# EAGLE schematic BMS Segment Jeff v2 (EAGLE 8.1.0)
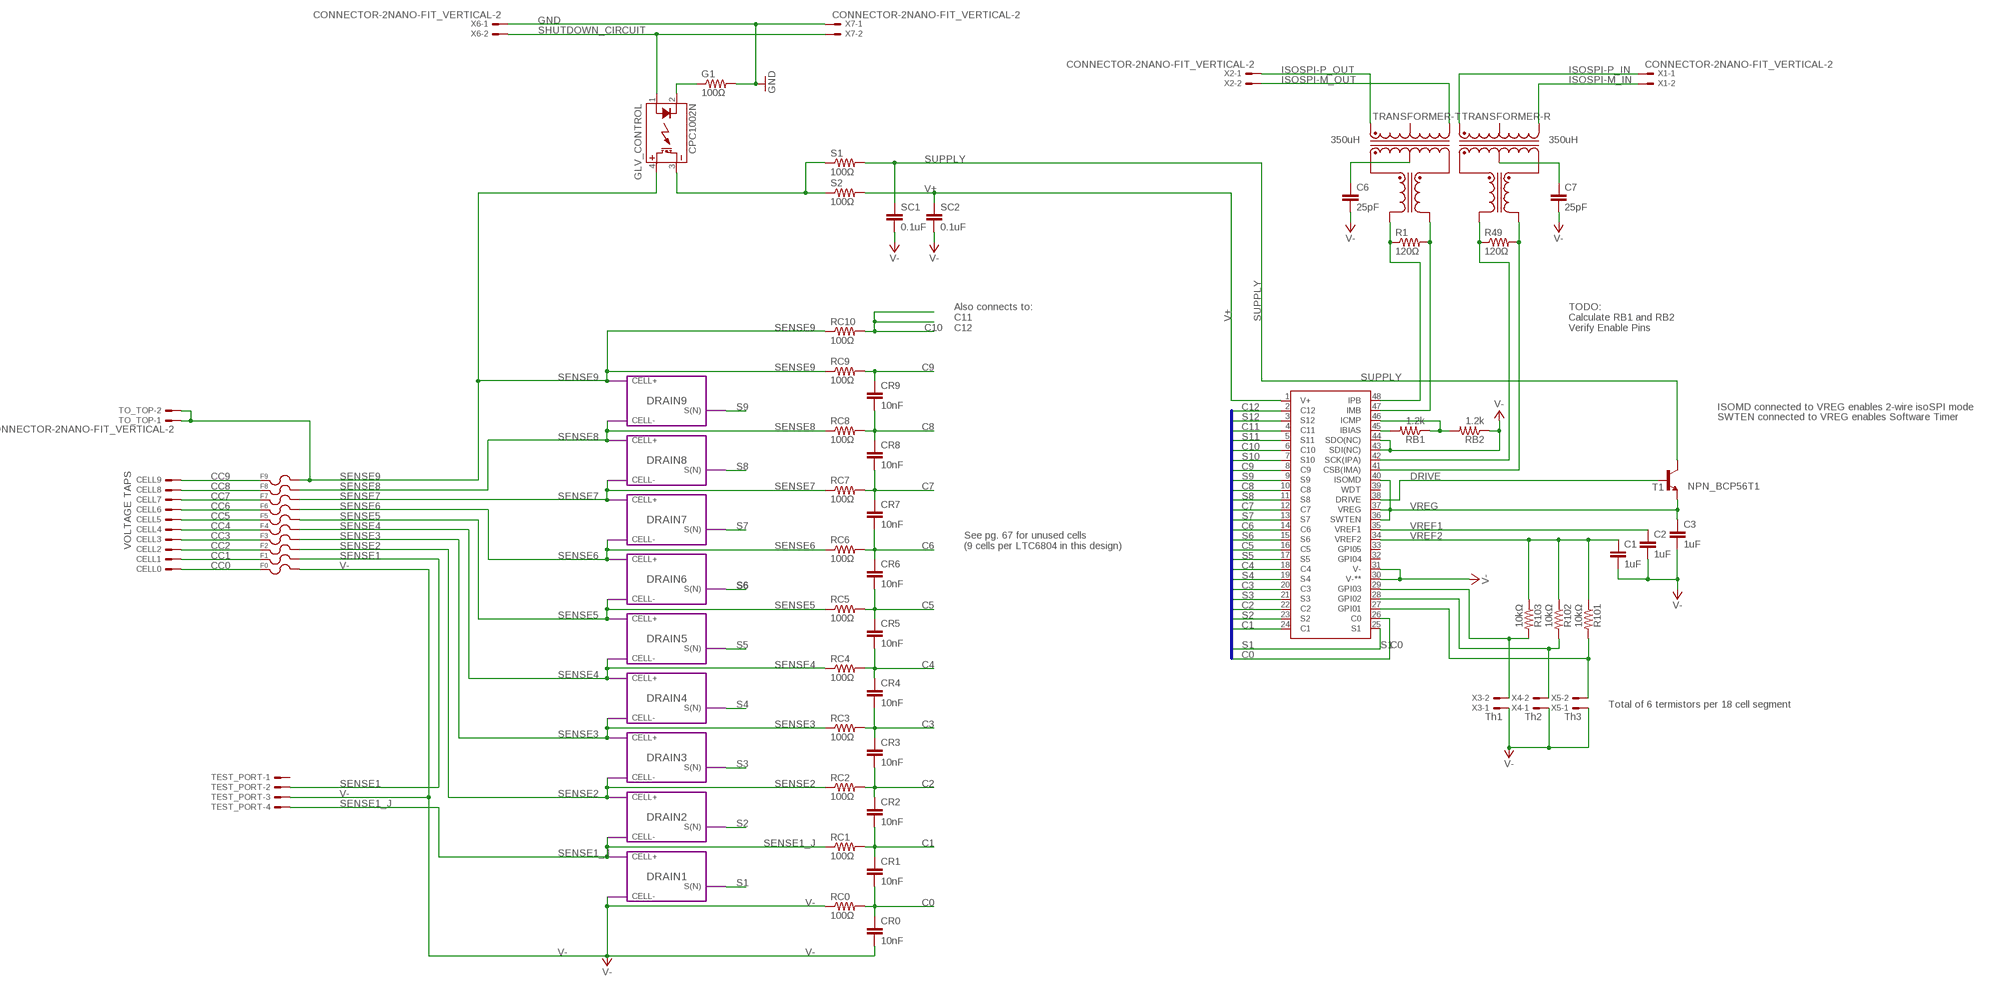
[diagram p0: schematic, sheet 1]

## Parts
C1  1uF  CAP0805  [0805]
C2  1uF  CAP0805  [0805]
C3  1uF  CAP0805  [0805]
C6  25pF  CAP0805  [0805]
C7  25pF  CAP0805  [0805]
CELL0  BATTERY_SPRING_KEYSTONE5222  [KEYSTONE5222]
CELL1  BATTERY_SPRING_KEYSTONE5222  [KEYSTONE5222]
CELL2  BATTERY_SPRING_KEYSTONE5222  [KEYSTONE5222]
CELL3  BATTERY_SPRING_KEYSTONE5222  [KEYSTONE5222]
CELL4  BATTERY_SPRING_KEYSTONE5222  [KEYSTONE5222]
CELL5  BATTERY_SPRING_KEYSTONE5222  [KEYSTONE5222]
CELL6  BATTERY_SPRING_KEYSTONE5222  [KEYSTONE5222]
CELL7  BATTERY_SPRING_KEYSTONE5222  [KEYSTONE5222]
CELL8  BATTERY_SPRING_KEYSTONE5222  [KEYSTONE5222]
CELL9  BATTERY_SPRING_KEYSTONE5222  [KEYSTONE5222]
CR0  10nF  CAP0805  [0805]
CR1  10nF  CAP0805  [0805]
CR2  10nF  CAP0805  [0805]
CR3  10nF  CAP0805  [0805]
CR4  10nF  CAP0805  [0805]
CR5  10nF  CAP0805  [0805]
CR6  10nF  CAP0805  [0805]
CR7  10nF  CAP0805  [0805]
CR8  10nF  CAP0805  [0805]
CR9  10nF  CAP0805  [0805]
F0  0751.0110_FUSE_CLIP  [0751.0110]
F1  0751.0110_FUSE_CLIP  [0751.0110]
F2  0751.0110_FUSE_CLIP  [0751.0110]
F3  0751.0110_FUSE_CLIP  [0751.0110]
F4  0751.0110_FUSE_CLIP  [0751.0110]
F5  0751.0110_FUSE_CLIP  [0751.0110]
F6  0751.0110_FUSE_CLIP  [0751.0110]
F7  0751.0110_FUSE_CLIP  [0751.0110]
F8  0751.0110_FUSE_CLIP  [0751.0110]
F9  0751.0110_FUSE_CLIP  [0751.0110]
G1  100Ω  RESISTOR0805-RES  [0805]
GLV_CONTROL  CPC1002N  [SOP04]
R1  120Ω  RESISTOR0805-RES  [0805]
R49  120Ω  RESISTOR0805-RES  [0805]
R101  10kΩ  RESISTOR0805-RES  [0805]
R102  10kΩ  RESISTOR0805-RES  [0805]
R103  10kΩ  RESISTOR0805-RES  [0805]
RB1  1.2k  RESISTOR0805-RES  [0805]
RB2  1.2k  RESISTOR0805-RES  [0805]
RC0  100Ω  RESISTOR0805-RES  [0805]
RC1  100Ω  RESISTOR0805-RES  [0805]
RC2  100Ω  RESISTOR0805-RES  [0805]
RC3  100Ω  RESISTOR0805-RES  [0805]
RC4  100Ω  RESISTOR0805-RES  [0805]
RC5  100Ω  RESISTOR0805-RES  [0805]
RC6  100Ω  RESISTOR0805-RES  [0805]
RC7  100Ω  RESISTOR0805-RES  [0805]
RC8  100Ω  RESISTOR0805-RES  [0805]
RC9  100Ω  RESISTOR0805-RES  [0805]
RC10  100Ω  RESISTOR0805-RES  [0805]
S1  100Ω  RESISTOR0805-RES  [0805]
S2  100Ω  RESISTOR0805-RES  [0805]
SC1  0.1uF  CAP0805  [0805]
SC2  0.1uF  CAP0805  [0805]
T1  NPN_BCP56T1  [SOT223]
TEST_PORT  MINIFIT_5566-4  [MINIFIT_5566-4]
TO_TOP  CONNECTOR-2NANO-FIT_VERTICAL-2  [NANO-FIT_VERTICAL-2]
TRANSFORMER-  350uH  TRANSFORMER_749010013  [749010013]
U$2  LTC6804-1  [LTC6804]
X1  CONNECTOR-2NANO-FIT_VERTICAL-2  [NANO-FIT_VERTICAL-2]
X2  CONNECTOR-2NANO-FIT_VERTICAL-2  [NANO-FIT_VERTICAL-2]
X3  Th1  CONNECTOR-2NANO-FIT_VERTICAL-2  [NANO-FIT_VERTICAL-2]
X4  Th2  CONNECTOR-2NANO-FIT_VERTICAL-2  [NANO-FIT_VERTICAL-2]
X5  Th3  CONNECTOR-2NANO-FIT_VERTICAL-2  [NANO-FIT_VERTICAL-2]
X6  CONNECTOR-2NANO-FIT_VERTICAL-2  [NANO-FIT_VERTICAL-2]
X7  CONNECTOR-2NANO-FIT_VERTICAL-2  [NANO-FIT_VERTICAL-2]

## Module instances
DRAIN1 = DRAIN
DRAIN2 = DRAIN
DRAIN3 = DRAIN
DRAIN4 = DRAIN
DRAIN5 = DRAIN
DRAIN6 = DRAIN
DRAIN7 = DRAIN
DRAIN8 = DRAIN
DRAIN9 = DRAIN

## Nets
C0: CR0.1 CR1.2 RC0.2 U$2.26(C0)
C1: CR1.1 CR2.2 RC1.2 U$2.24(C1)
C2: CR2.1 CR3.2 RC2.2 U$2.22(C2)
C3: CR3.1 CR4.2 RC3.2 U$2.20(C3)
C4: CR4.1 CR5.2 RC4.2 U$2.18(C4)
C5: CR5.1 CR6.2 RC5.2 U$2.16(C5)
C6: CR6.1 CR7.2 RC6.2 U$2.14(C6)
C7: CR7.1 CR8.2 RC7.2 U$2.12(C7)
C8: CR8.1 CR9.2 RC8.2 U$2.10(C8)
C9: CR9.1 RC9.2 U$2.8(C9)
C10: RC10.2 U$2.6(C10)
C11: U$2.4(C11)
C12: U$2.2(C12)
CC0: CELL0.P$1(S) F0.L1 F0.L2
CC1: CELL1.P$1(S) F1.L1 F1.L2
CC2: CELL2.P$1(S) F2.L1 F2.L2
CC3: CELL3.P$1(S) F3.L1 F3.L2
CC4: CELL4.P$1(S) F4.L1 F4.L2
CC5: CELL5.P$1(S) F5.L1 F5.L2
CC6: CELL6.P$1(S) F6.L1 F6.L2
CC7: CELL7.P$1(S) F7.L1 F7.L2
CC8: CELL8.P$1(S) F8.L1 F8.L2
CC9: CELL9.P$1(S) F9.L1 F9.L2
DRIVE: T1.1(BASE) U$2.38(DRIVE)
GND: G1.2 X6.1 X7.1
ISOSPI-M_IN: TRANSFORMER-.8(R:D-) X1.2
ISOSPI-M_OUT: TRANSFORMER-.3(T:D-) X2.2
ISOSPI-P_IN: TRANSFORMER-.6(R:D+) X1.1
ISOSPI-P_OUT: TRANSFORMER-.1(T:D+) X2.1
N$1: C7.1 TRANSFORMER-.10(R:CX)
N$2: C6.1 TRANSFORMER-.15(T:CX)
N$4: RB1.2 U$2.45(IBIAS)
N$5: R1.1 TRANSFORMER-.16(T:X+) U$2.48(IPB)
N$7: RB1.1 RB2.2 U$2.46(ICMP)
N$8: R49.1 TRANSFORMER-.11(R:X+) U$2.42(SCK(IPA))
N$9: R49.2 TRANSFORMER-.9(R:X-) U$2.41(CSB(IMA))
N$42: R1.2 TRANSFORMER-.14(T:X-) U$2.47(IMB)
S1: U$2.25(S1) ; port DRAIN1.S(N)
S2: U$2.23(S2) ; port DRAIN2.S(N)
S3: U$2.21(S3) ; port DRAIN3.S(N)
S4: U$2.19(S4) ; port DRAIN4.S(N)
S5: U$2.17(S5) ; port DRAIN5.S(N)
S6: U$2.15(S6) ; port DRAIN6.S(N)
S7: U$2.13(S7) ; port DRAIN7.S(N)
S8: U$2.11(S8) ; port DRAIN8.S(N)
S9: U$2.9(S9) ; port DRAIN9.S(N)
S10: U$2.7(S10)
S11: U$2.5(S11)
S12: U$2.3(S12)
SENSE1: F1.R1 F1.R2 TEST_PORT.2
SENSE1_J: RC1.1 TEST_PORT.4 ; port DRAIN1.CELL+ DRAIN2.CELL-
SENSE2: F2.R1 F2.R2 RC2.1 ; port DRAIN2.CELL+ DRAIN3.CELL-
SENSE3: F3.R1 F3.R2 RC3.1 ; port DRAIN3.CELL+ DRAIN4.CELL-
SENSE4: F4.R1 F4.R2 RC4.1 ; port DRAIN4.CELL+ DRAIN5.CELL-
SENSE5: F5.R1 F5.R2 RC5.1 ; port DRAIN5.CELL+ DRAIN6.CELL-
SENSE6: F6.R1 F6.R2 RC6.1 ; port DRAIN6.CELL+ DRAIN7.CELL-
SENSE7: F7.R1 F7.R2 RC7.1 ; port DRAIN7.CELL+ DRAIN8.CELL-
SENSE8: F8.R1 F8.R2 RC8.1 ; port DRAIN8.CELL+ DRAIN9.CELL-
SENSE9: F9.R1 F9.R2 GLV_CONTROL.4(DC+) RC9.1 RC10.1 TO_TOP.1 TO_TOP.2 ; port DRAIN9.CELL+
SHUTDOWN_CIRCUIT: GLV_CONTROL.1(CONTROL+) X6.2 X7.2
SSR-: G1.1 GLV_CONTROL.2(CONTROL-)
SUPPLY: S1.2 SC1.1 T1.2(COLLECTOR) T1.4(COLLECTOR)
SUPPLY_INTER: GLV_CONTROL.3(DC-) S1.1 S2.1
THERMISTOR1: R101.2 U$2.27(GPI01) X5.2
THERMISTOR2: R102.2 U$2.28(GPI02) X4.2
THERMISTOR3: R103.2 U$2.29(GPI03) X3.2
V+: S2.2 SC2.1 U$2.1(V+)
V-: C1.2 C2.2 C3.2 C6.2 C7.2 CR0.2 F0.R1 F0.R2 RB2.1 RC0.1 SC1.2 SC2.2 TEST_PORT.3 U$2.30(V-**) U$2.31(V-) U$2.43(SDI(NC)) U$2.44(SDO(NC)) X3.1 X4.1 X5.1 ; port DRAIN1.CELL-
VREF1: C2.1 U$2.35(VREF1)
VREF2: C1.1 R101.1 R102.1 R103.1 U$2.34(VREF2)
VREG: C3.1 T1.3(EMITTER) U$2.36(SWTEN) U$2.37(VREG) U$2.40(ISOMD)
Unconnected: TEST_PORT.1 TRANSFORMER-.2(T:CD) TRANSFORMER-.7(R:CD) U$2.32(GPI04) U$2.33(GPI05) U$2.39(WDT)

## Buses
C[0..12],S[1..12]

## Notes on the sheet
- Also connects to:
  C11
  C12
- TODO:
  Calculate RB1 and RB2
  Verify Enable Pins
- ISOMD connected to VREG enables 2-wire isoSPI mode
- SWTEN connected to VREG enables Software Timer
- VOLTAGE TAPS
- See pg. 67 for unused cells
  (9 cells per LTC6804 in this design)
- Total of 6 termistors per 18 cell segment

## Library data of the parts
C1-C3 C6 C7 CR0 CR1-CR9 SC1 SC2 = HyTechDevices:CAP: Capacitor Standard 0603 ceramic capacitor, and 0.1" leaded capacitor.
CELL0 CELL1-CELL9 = HyTechDevices:BATTERY_SPRING
F0 F1-F9 = HyTechDevices:0751.0110_FUSE_CLIP: Schurter 0751.0110 Brass Fuse Clip Datasheet <http://www.mouser.com/ds/2/358/typ_OG__Clip__5x20-2553.pdf>
G1 R1 R49 R101-R103 RB1 RB2 RC0 RC1-RC10 S1 S2 = HyTechDevices:RESISTOR: Resistor Basic schematic elements and footprints for 0603, 1206, and PTH resistors.
GLV_CONTROL = HyTechDevices:CPC1002N: IXYS Solid State Relay .7A
T1 = HyTechDevices:NPN_BCP56T1: ON Semiconductor BCP56 Series NPN Silicon Epitaxial Transistor Datasheet <http://www.mouser.com/ds/2/308/BCP56T1-D-104805.pdf>
TEST_PORT = HyTechDevices:MINIFIT_5566-4: Mini-Fit Junior connector 4 pole Source: http://www.molex.com; OC_FARNELL: unknown; OC_NEWARK: unknown
TO_TOP X1-X7 = HyTechDevices:CONNECTOR-2: Mini-Fit Junior connector 2 pole Source: http://www.molex.com
TRANSFORMER- = HyTechDevices:TRANSFORMER_749010013: Wurth Electronics Midcom 749010013 10/100BaseTX Ethernet Transformer Datasheet <http://www.mouser.com/ds/2/445/749010013-311000.pdf> Mouser Page <http://www.mouser.com/ProductDetail/Wurth-Electronics-Midcom/749010013/?qs=40TFAHZMFvcjCZphxWYgVw%3D%3D>
U$2 = HyTechDevices:LTC6804-1

## Module DRAIN
Ports: CELL+(in) CELL-(out) S(N)(io)
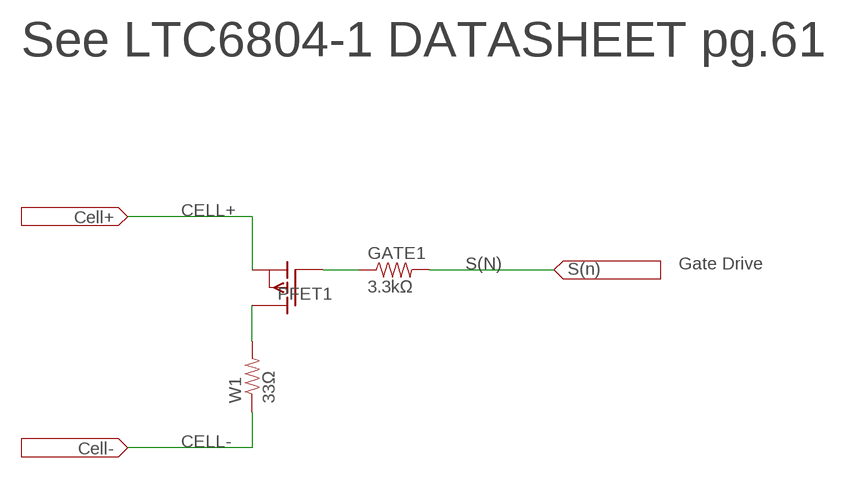
[diagram p1: schematic, module DRAIN, sheet 1]

### Parts
GATE1  3.3kΩ  RESISTOR0805-RES  [0805]
PFET1  P-CHANNEL_MOSFET_DMP3099L-7  [SOT23]
W1  33Ω  RESISTOR2512  [R2512]

### Nets
CELL+: PFET1.2(S)
CELL-: W1.1
DRAIN: PFET1.3(D) W1.2
GATE: GATE1.1 PFET1.1(G)
S(N): GATE1.2

### Notes on the sheet
- See LTC6804-1 DATASHEET pg.61
- Gate Drive

### Library data of the parts
GATE1 W1 = HyTechDevices:RESISTOR: Resistor Basic schematic elements and footprints for 0603, 1206, and PTH resistors.
PFET1 = HyTechDevices:P-CHANNEL_MOSFET_DMP3099L-7: Diodes Incorporated P-Channel Enhancement Mode MOSFET Datasheet <http://www.mouser.com/ds/2/115/DMP3099L-266220.pdf>